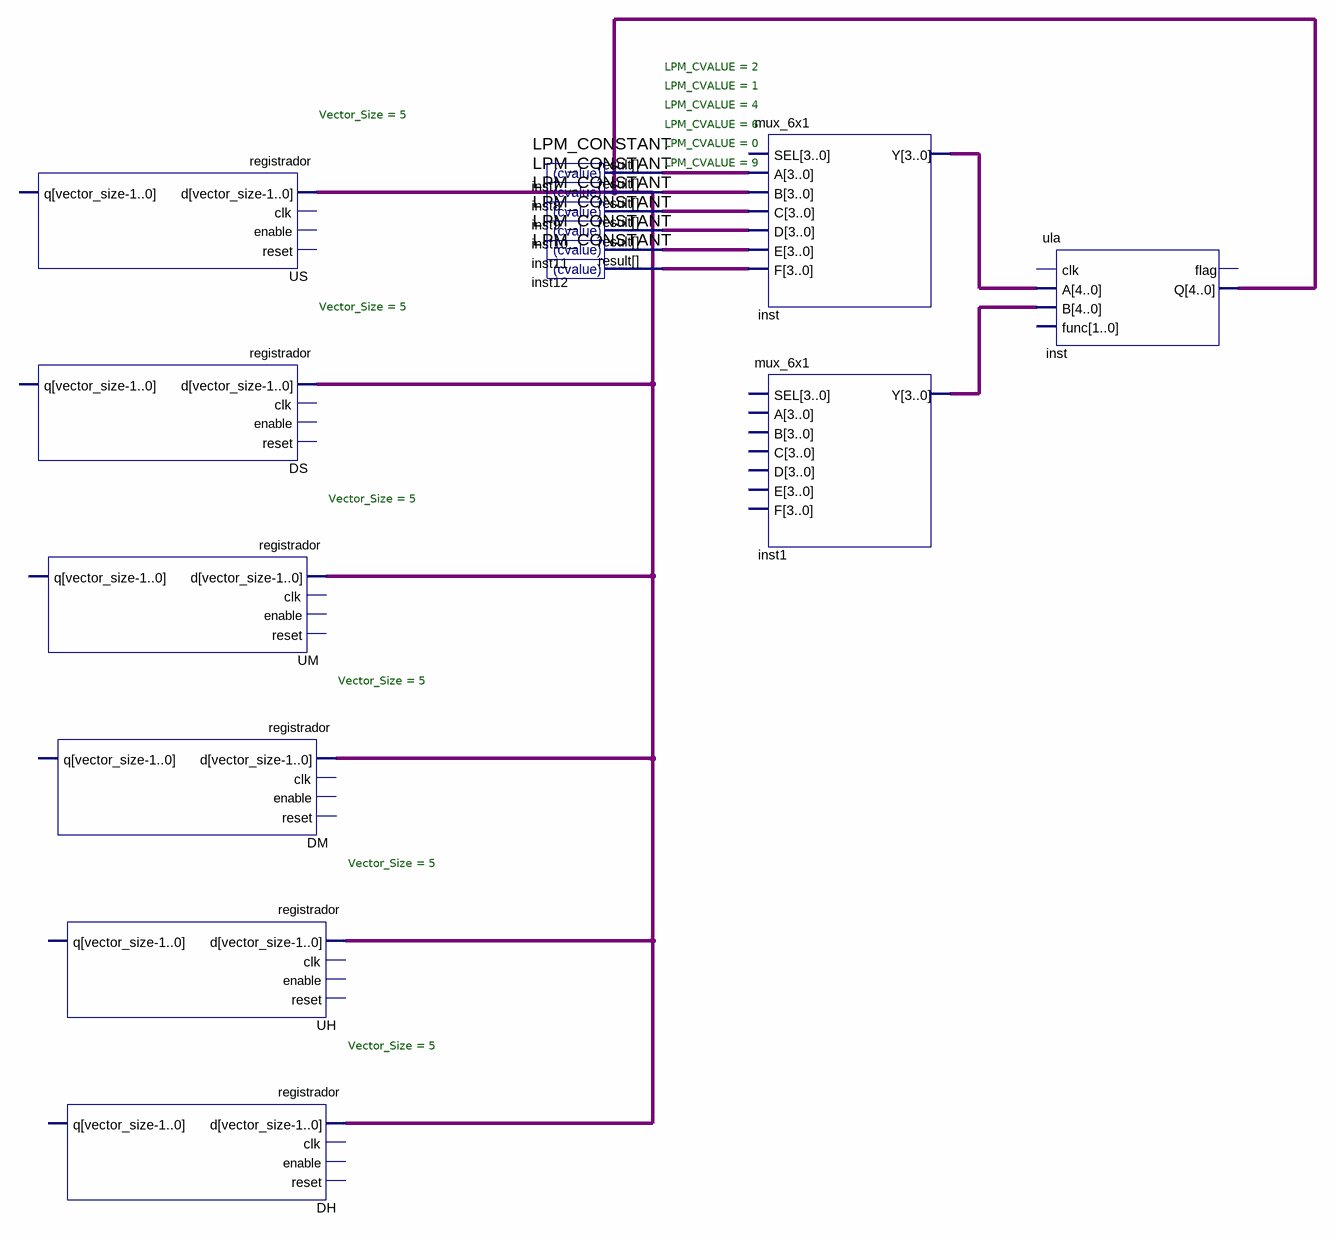
[diagram p0: schematic sheet]
// Quartus schematic Block1.bdf as structural Verilog: 15 symbols, 0 pins
module Block1 (
);

  wire [3:0] inst7_result, inst8_result, inst9_result, inst10_result, inst11_result, inst12_result;
  wire [4:0] inst1_y, inst_q, inst_y;

  registrador #(.Vector_Size(5)) US (.d(inst_q));  // open: clk, enable, reset, q
  registrador #(.Vector_Size(5)) DS (.d(inst_q));  // open: clk, enable, reset, q
  registrador #(.Vector_Size(5)) UM (.d(inst_q));  // open: clk, enable, reset, q
  registrador #(.Vector_Size(5)) DM (.d(inst_q));  // open: clk, enable, reset, q
  registrador #(.Vector_Size(5)) UH (.d(inst_q));  // open: clk, enable, reset, q
  registrador #(.Vector_Size(5)) DH (.d(inst_q));  // open: clk, enable, reset, q
  LPM_CONSTANT #(.LPM_CVALUE(2)) inst7 (.result(inst7_result));
  LPM_CONSTANT #(.LPM_CVALUE(1)) inst8 (.result(inst8_result));
  LPM_CONSTANT #(.LPM_CVALUE(4)) inst9 (.result(inst9_result));
  LPM_CONSTANT #(.LPM_CVALUE(6)) inst10 (.result(inst10_result));
  LPM_CONSTANT #(.LPM_CVALUE(0)) inst11 (.result(inst11_result));
  LPM_CONSTANT #(.LPM_CVALUE(9)) inst12 (.result(inst12_result));
  mux_6x1 inst (
    .A(inst7_result), .B(inst8_result), .C(inst9_result), .D(inst10_result), .E(inst11_result),
    .F(inst12_result), .Y(inst_y));  // open: SEL
  mux_6x1 inst1 (.Y(inst1_y));  // open: SEL, A, B, C, D, E, F
  ula inst_dup2 (.A(inst_y), .B(inst1_y), .Q(inst_q));  // open: clk, func, flag
endmodule
